# Altium schematic sheet 06cpu_soc.SchDoc
size B
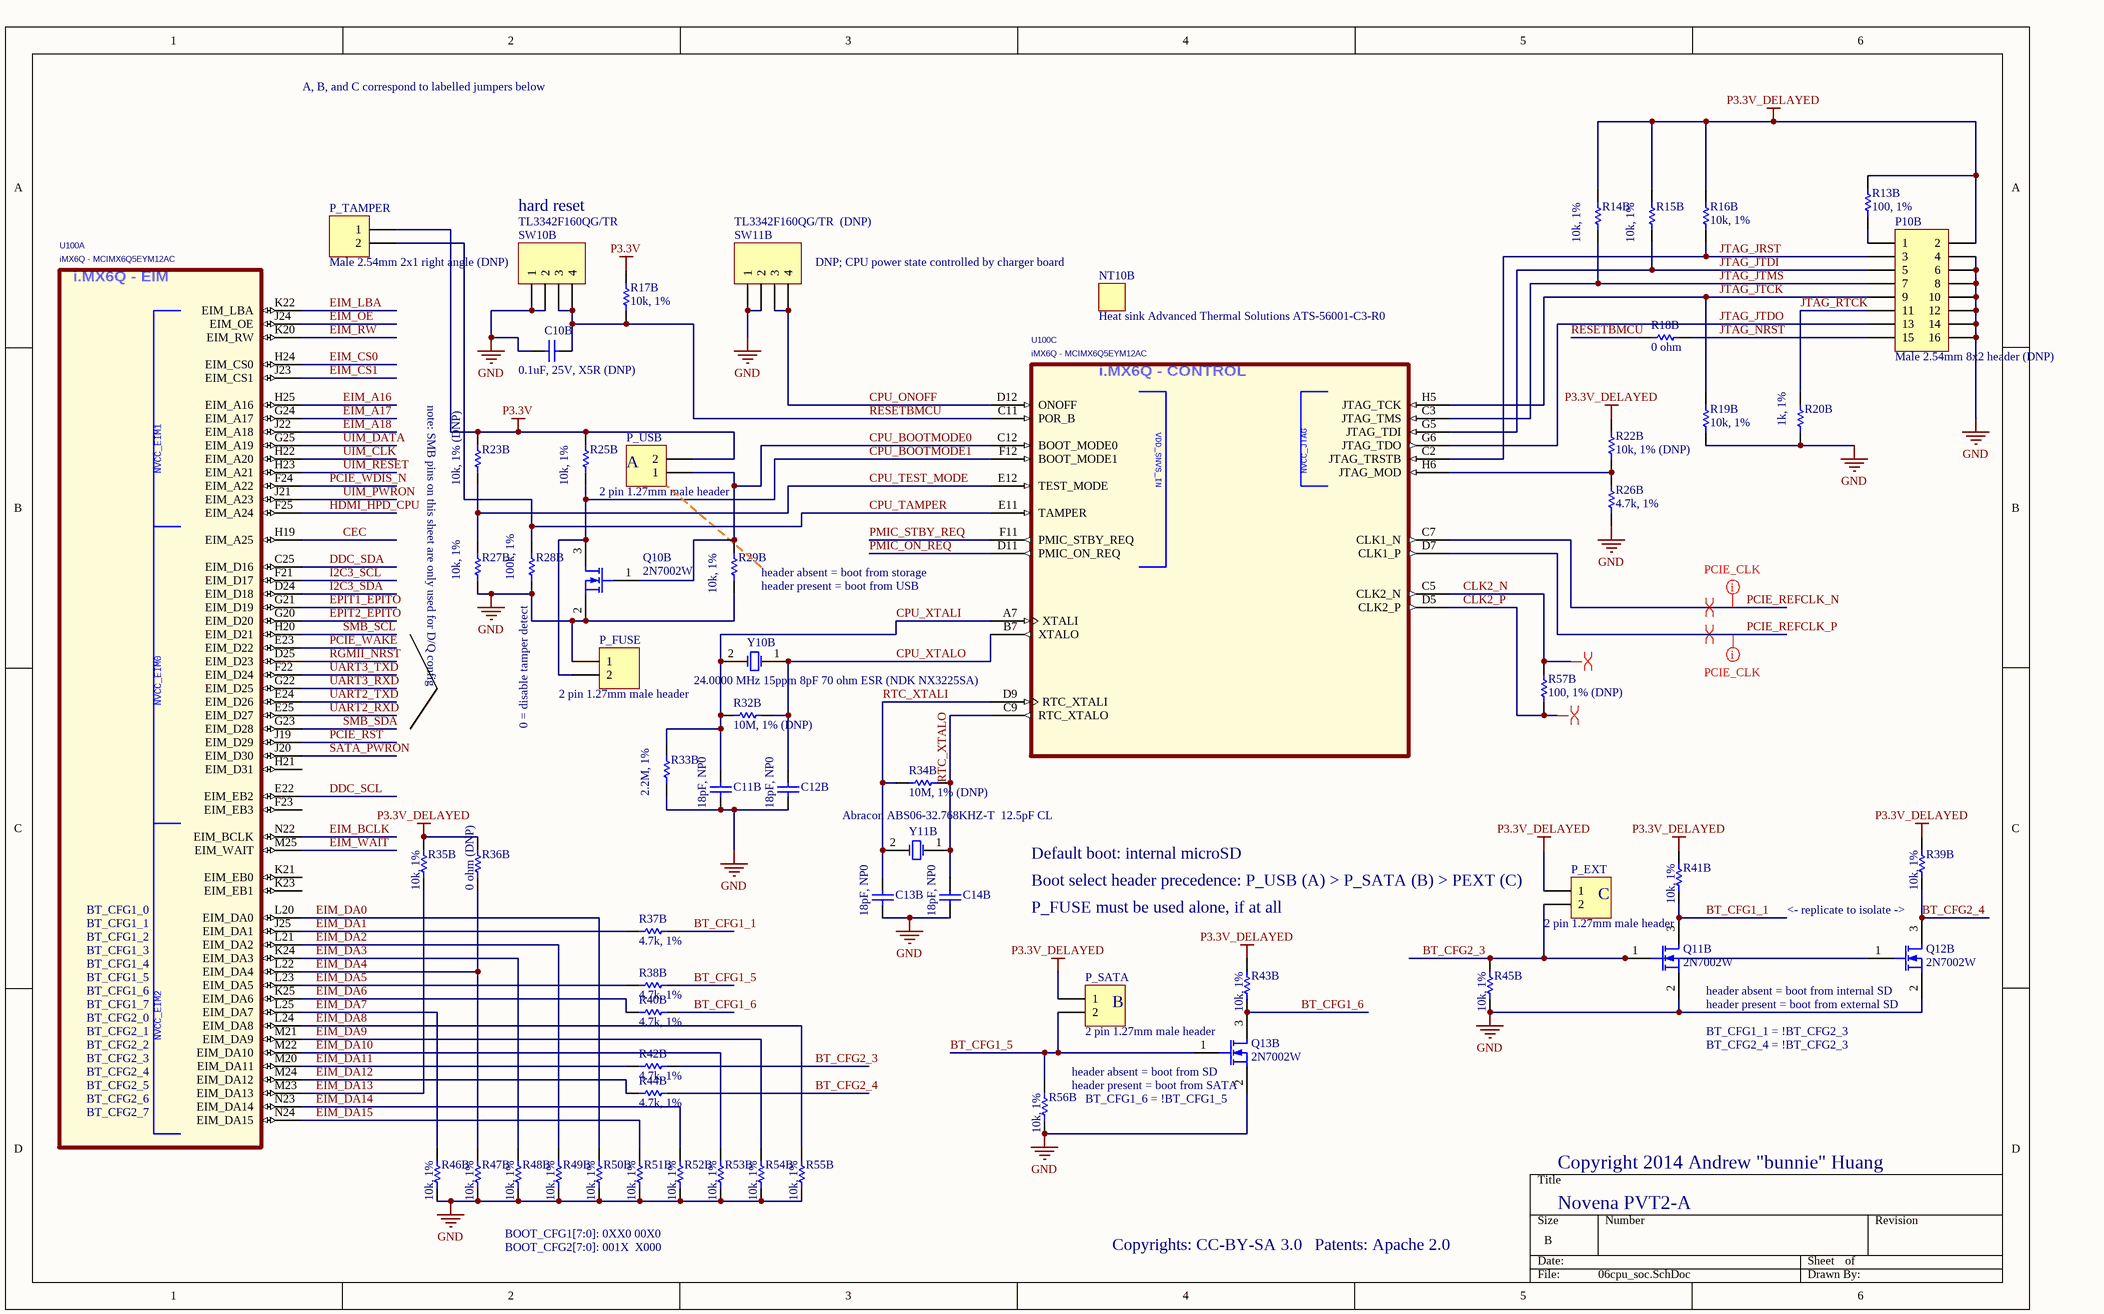
[diagram p0: 06cpu_soc.SchDoc]

## Parts
C10B  0.1uF, 25V, X5R (DNP)  [CAPC1005N]
C11B  18pF, NP0  [CAPC1005N]
C12B  18pF, NP0  [CAPC1005N]
C13B  18pF, NP0  [CAPC1005N]
C14B  18pF, NP0  [CAPC1005N]
NT10B  Heat sink Advanced Thermal Solutions ATS-56001-C3-R0
P10B  Male 2.54mm 8x2 header (DNP)  [HDR2X8]
P_EXT  2 pin 1.27mm male header  [HEADER_2_1.27MM]
P_FUSE  2 pin 1.27mm male header  [HEADER_2_1.27MM]
P_SATA  2 pin 1.27mm male header  [HEADER_2_1.27MM]
P_TAMPER  Male 2.54mm 2x1 right angle (DNP)  [HDR1X2H]
P_USB  2 pin 1.27mm male header  [HEADER_2_1.27MM]
Q10B  2N7002W  [SOT323-3AN]
Q11B  2N7002W  [SOT323-3AN]
Q12B  2N7002W  [SOT323-3AN]
Q13B  2N7002W  [SOT323-3AN]
R13B  100, 1%  [RESC1005N]
R14B  10k, 1%  [RESC1005N]
R15B  10k, 1%  [RESC1005N]
R16B  10k, 1%  [RESC1005N]
R17B  10k, 1%  [RESC1005N]
R18B  0 ohm  [RESC1005N]
R19B  10k, 1%  [RESC1005N]
R20B  1k, 1%  [RESC1005N]
R22B  10k, 1% (DNP)  [RESC1005N]
R23B  10k, 1% (DNP)  [RESC1005N]
R25B  10k, 1%  [RESC1005N]
R26B  4.7k, 1%  [RESC1005N]
R27B  10k, 1%  [RESC1005N]
R28B  100k, 1%  [RESC1005N]
R29B  10k, 1%  [RESC1005N]
R32B  10M, 1% (DNP)  [RESC1005N]
R33B  2.2M, 1%  [RESC1005N]
R34B  10M, 1% (DNP)  [RESC1005N]
R35B  10k, 1%  [RESC1005N]
R36B  0 ohm (DNP)  [RESC1005N]
R37B  4.7k, 1%  [RESC1005N]
R38B  4.7k, 1%  [RESC1005N]
R39B  10k, 1%  [RESC1005N]
R40B  4.7k, 1%  [RESC1005N]
R41B  10k, 1%  [RESC1005N]
R42B  4.7k, 1%  [RESC1005N]
R43B  10k, 1%  [RESC1005N]
R44B  4.7k, 1%  [RESC1005N]
R45B  10k, 1%  [RESC1005N]
R46B  10k, 1%  [RESC1005N]
R47B  10k, 1%  [RESC1005N]
R48B  10k, 1%  [RESC1005N]
R49B  10k, 1%  [RESC1005N]
R50B  10k, 1%  [RESC1005N]
R51B  10k, 1%  [RESC1005N]
R52B  10k, 1%  [RESC1005N]
R53B  10k, 1%  [RESC1005N]
R54B  10k, 1%  [RESC1005N]
R55B  10k, 1%  [RESC1005N]
R56B  10k, 1%  [RESC1005N]
R57B  100, 1% (DNP)  [RESC1005N]
SW10B  TL3342F160QG/TR  [SWITCH_TS-1187A]
SW11B  TL3342F160QG/TR  (DNP)  [SWITCH_TS-1187A]
U100  iMX6Q - MCIMX6Q5EYM12AC  [FREESCALE_BGA624C80P25X25_2100X2100X216]  (parts A,C of 12)
Y10B  24.0000 MHz 15ppm 8pF 70 ohm ESR (NDK NX3225SA)  [NDK_NX3225SA]
Y11B  Abracon ABS06-32.768KHZ-T  12.5pF CL  [ABS06]

## Nets
GND: C10B.2 C11B.2 C12B.2 C13B.2 C14B.2 P10B.4 P10B.6 P10B.8 P10B.10 P10B.12 P10B.14 P10B.16 P_FUSE.1 Q10B.2(S) Q11B.2(S) Q12B.2(S) Q13B.2(S) R19B.1 R20B.1 R26B.1 R27B.1 R28B.1 R29B.1 R33B.2 R45B.2 R46B.2 R47B.2 R48B.2 R49B.2 R50B.2 R51B.2 R52B.2 R53B.2 R54B.2 R55B.2 R56B.2 SW10B.1 SW10B.2 SW11B.1 SW11B.2
P3.3V: P_TAMPER.1 P_USB.2 R17B.2 R23B.2 R25B.2
P3.3V_DELAYED: P10B.2 P_EXT.1 P_SATA.1 R13B.2 R14B.2 R15B.2 R16B.2 R22B.2 R35B.1 R36B.1 R39B.1 R41B.1 R43B.1
BT_CFG1_1: Q11B.3(D) R37B.2 R41B.2
BT_CFG1_5: P_SATA.2 Q13B.1(G) R38B.2 R56B.1
BT_CFG1_6: Q13B.3(D) R40B.2 R43B.2
BT_CFG2_3: P_EXT.2 Q11B.1(G) Q12B.1(G) R42B.2 R45B.1
BT_CFG2_4: Q12B.3(D) R39B.2 R44B.2
CEC: U100.H19(EIM_A25)
CLK2_N: R57B.2 U100.C5(CLK2_N)
CLK2_P: R57B.1 U100.D5(CLK2_P)
CPU_BOOTMODE0: P_USB.1 Q10B.1(G) R29B.2 U100.C12(BOOT_MODE0)
CPU_BOOTMODE1: P_FUSE.2 Q10B.3(D) R25B.1 U100.F12(BOOT_MODE1)
CPU_ONOFF: SW11B.3 SW11B.4 U100.D12(ONOFF)
CPU_TAMPER: P_TAMPER.2 R28B.2 U100.E11(TAMPER)
CPU_TEST_MODE: R23B.1 R27B.2 U100.E12(TEST_MODE)
CPU_XTALI: C11B.1 R32B.1 R33B.1 U100.A7(XTALI) Y10B.2(OSC2)
CPU_XTALO: C12B.1 R32B.2 U100.B7(XTALO) Y10B.1(OSC1)
DDC_SCL: U100.E22(EIM_EB2)
DDC_SDA: U100.C25(EIM_D16)
EIM_A16: U100.H25(EIM_A16)
EIM_A17: U100.G24(EIM_A17)
EIM_A18: U100.J22(EIM_A18)
EIM_BCLK: U100.N22(EIM_BCLK)
EIM_CS0: U100.H24(EIM_CS0)
EIM_CS1: U100.J23(EIM_CS1)
EIM_DA0: R50B.1 U100.L20(EIM_DA0)
EIM_DA1: R37B.1 U100.J25(EIM_DA1)
EIM_DA2: R49B.1 U100.L21(EIM_DA2)
EIM_DA3: R48B.1 U100.K24(EIM_DA3)
EIM_DA4: R36B.2 R47B.1 U100.L22(EIM_DA4)
EIM_DA5: R38B.1 U100.L23(EIM_DA5)
EIM_DA6: R40B.1 U100.K25(EIM_DA6)
EIM_DA7: R46B.1 U100.L25(EIM_DA7)
EIM_DA8: R55B.1 U100.L24(EIM_DA8)
EIM_DA9: R54B.1 U100.M21(EIM_DA9)
EIM_DA10: R53B.1 U100.M22(EIM_DA10)
EIM_DA11: R42B.1 U100.M20(EIM_DA11)
EIM_DA12: R44B.1 U100.M24(EIM_DA12)
EIM_DA13: R35B.2 U100.M23(EIM_DA13)
EIM_DA14: R52B.1 U100.N23(EIM_DA14)
EIM_DA15: R51B.1 U100.N24(EIM_DA15)
EIM_LBA: U100.K22(EIM_LBA)
EIM_OE: U100.J24(EIM_OE)
EIM_RW: U100.K20(EIM_RW)
EIM_WAIT: U100.M25(EIM_WAIT)
EPIT1_EPITO: U100.G21(EIM_D19)
EPIT2_EPITO: U100.G20(EIM_D20)
HDMI_HPD_CPU: U100.F25(EIM_A24)
I2C3_SCL: U100.F21(EIM_D17)
I2C3_SDA: U100.D24(EIM_D18)
JTAG_JRST: P10B.3 R16B.1 U100.C2(JTAG_TRSTB)
JTAG_JTCK: P10B.9 R19B.2 U100.H5(JTAG_TCK)
JTAG_JTDI: P10B.5 R15B.1 U100.G5(JTAG_TDI)
JTAG_JTDO: P10B.13 U100.G6(JTAG_TDO)
JTAG_JTMS: P10B.7 R14B.1 U100.C3(JTAG_TMS)
JTAG_NRST: P10B.15 R18B.1
JTAG_RTCK: P10B.11 R20B.2
PCIE_REFCLK_N: U100.C7(CLK1_N)
PCIE_REFCLK_P: U100.D7(CLK1_P)
PCIE_RST: U100.J19(EIM_D29)
PCIE_WAKE: U100.E23(EIM_D22)
PCIE_WDIS_N: U100.F24(EIM_A22)
PMIC_ON_REQ: U100.D11(PMIC_ON_REQ)
PMIC_STBY_REQ: U100.F11(PMIC_STBY_REQ)
RESETBMCU: C10B.1 R17B.1 R18B.2 SW10B.3 SW10B.4 U100.C11(POR_B)
RGMII_NRST: U100.D25(EIM_D23)
RTC_XTALI: C13B.1 R34B.1 U100.D9(RTC_XTALI) Y11B.2(OSC2)
RTC_XTALO: C14B.1 R34B.2 U100.C9(RTC_XTALO) Y11B.1(OSC1)
SATA_PWRON: U100.J20(EIM_D30)
SMB_SCL: U100.H20(EIM_D21)
SMB_SDA: U100.G23(EIM_D28)
UART2_RXD: U100.E25(EIM_D27)
UART2_TXD: U100.E24(EIM_D26)
UART3_RXD: U100.G22(EIM_D25)
UART3_TXD: U100.F22(EIM_D24)
UIM_CLK: U100.H22(EIM_A20)
UIM_DATA: U100.G25(EIM_A19)
UIM_PWRON: U100.J21(EIM_A23)
UIM_RESET: U100.H23(EIM_A21)
NetP10B_1: P10B.1 R13B.1
NetR22B_1: R22B.1 R26B.2 U100.H6(JTAG_MOD)

Not connected (* = marked no-connect by the designer): U100 F23(EIM_EB3) H21(EIM_D31) K21(EIM_EB0) K23(EIM_EB1)

## Layout directives
differential pair: CLK2_N, CLK2_P, PCIE_REFCLK_N, PCIE_REFCLK_P
net class PCIE_CLK: PCIE_REFCLK_N, PCIE_REFCLK_P

## Notes on the sheet
- A, B, and C correspond to labelled jumpers below
- hard reset
- DNP; CPU power state controlled by charger board
- note: SMB pins on this sheet are only used for D/Q config
- A
- (near R29B) header absent = boot from storage
- (near R29B) header present = boot from USB
- (near R28B) 0 = disable tamper detect
- Default boot: internal microSD
- BT_CFG1_0
- BT_CFG1_1
- (near P_EXT) Boot select header precedence: P_USB (A) > P_SATA (B) > PEXT (C)
- P_FUSE must be used alone, if at all
- (near P_EXT) C
- <- replicate to isolate ->
- BT_CFG1_2
- BT_CFG1_3
- BT_CFG1_4
- BT_CFG1_5
- BT_CFG1_6
- (near Q12B) header absent = boot from internal SD
- BT_CFG1_7
- BT_CFG2_0
- BT_CFG2_1
- BT_CFG2_2
- BT_CFG2_3
- (near P_SATA) B
- header present = boot from external SD
- BT_CFG1_1 = !BT_CFG2_3
- BT_CFG2_4 = !BT_CFG2_3
- BT_CFG2_4
- BT_CFG2_5
- BT_CFG2_6
- BT_CFG2_7
- (near Q13B) header absent = boot from SD
- (near Q13B) header present = boot from SATA
- BT_CFG1_6 = !BT_CFG1_5
- Copyright 2014 Andrew "bunnie" Huang
- BOOT_CFG1[7:0]: 0XX0 00X0
- BOOT_CFG2[7:0]: 001X  X000
- Copyrights: CC-BY-SA 3.0
- Patents: Apache 2.0
- Novena PVT2-A
- (in symbol PCIMX6Q6VV1A, part A) i.MX6Q - EIM
- (in symbol PCIMX6Q6VV1A, part C) i.MX6Q - CONTROL

## Library data of the parts
C10B C11B C12B C13B C14B = Cap Semi: Capacitor (Semiconductor SIM Model); Published: 8-Jun-2000; LatestRevisionDate: 17-Jul-2002; LatestRevisionNote: Re-released for DXP Platform.; PackageReference: C1206; Publisher: Altium Limited
NT10B = NOTE: Placeholder for non-electrical BOM items
P10B = Header 8X2: Header, 8-Pin, Dual row; LatestRevisionDate: 17-Jul-2002; LatestRevisionNote: Re-released for DXP Platform.; Publisher: Altium Limited
P_EXT P_FUSE P_SATA P_USB = Header 2: Header, 2-Pin; LatestRevisionDate: 17-Jul-2002; LatestRevisionNote: Re-released for DXP Platform.; Publisher: Altium Limited
P_TAMPER = Header 2H: Header, 2-Pin, Right Angle; LatestRevisionDate: 17-Jul-2002; LatestRevisionNote: Re-released for DXP Platform.; Publisher: Altium Limited
Q10B Q11B Q12B Q13B = MOSFET-N: N-Channel MOSFET; Published: 8-Jun-2000; LatestRevisionDate: 17-Jul-2002; LatestRevisionNote: Re-released for DXP Platform.; PackageVersion: 1995/1996; PackageReference: E3; Publisher: Altium Limited
R13B R14B R15B R16B R17B R18B R19B R20B R22B R23B R25B R26B R27B R29B R32B R33B R34B R35B R36B R37B R38B R39B R40B R41B R42B R43B R44B R45B R46B R47B R48B R49B R50B R51B R52B R53B R54B R55B R56B R57B = Res1: Resistor; Value: 100k; Published: 8-Jun-2000; LatestRevisionDate: 17-Jul-2002; LatestRevisionNote: Re-released for DXP Platform.; PackageReference: AXIAL-0.3; Publisher: Altium Limited
R28B = Res1: Resistor; Published: 8-Jun-2000; LatestRevisionDate: 17-Jul-2002; LatestRevisionNote: Re-released for DXP Platform.; PackageReference: AXIAL-0.3; Publisher: Altium Limited; Value: 100k
SW10B SW11B = Header 4: Chi Fung TS-1187A; LatestRevisionDate: 17-Jul-2002; LatestRevisionNote: Re-released for DXP Platform.; Publisher: Altium Limited
U100 = PCIMX6Q6VV1A: PCIMX6Q5EVT10AC; AGILE_PN: TMP-WF-14526; MFG_NAME01: Freescale Semiconductor; PRE_APN: 344-01218; MFG_PN01: PCIMX6Q6VV1A; ROHS: Yes; HEIGHT: 2.16MM
Y10B Y11B = XTAL: Crystal Oscillator; Published: 8-Jun-2000; LatestRevisionDate: 17-Jul-2002; LatestRevisionNote: Re-released for DXP Platform.; PackageReference: R38; Publisher: Altium Limited